# EAGLE design schemat (EAGLE 9.2.2)
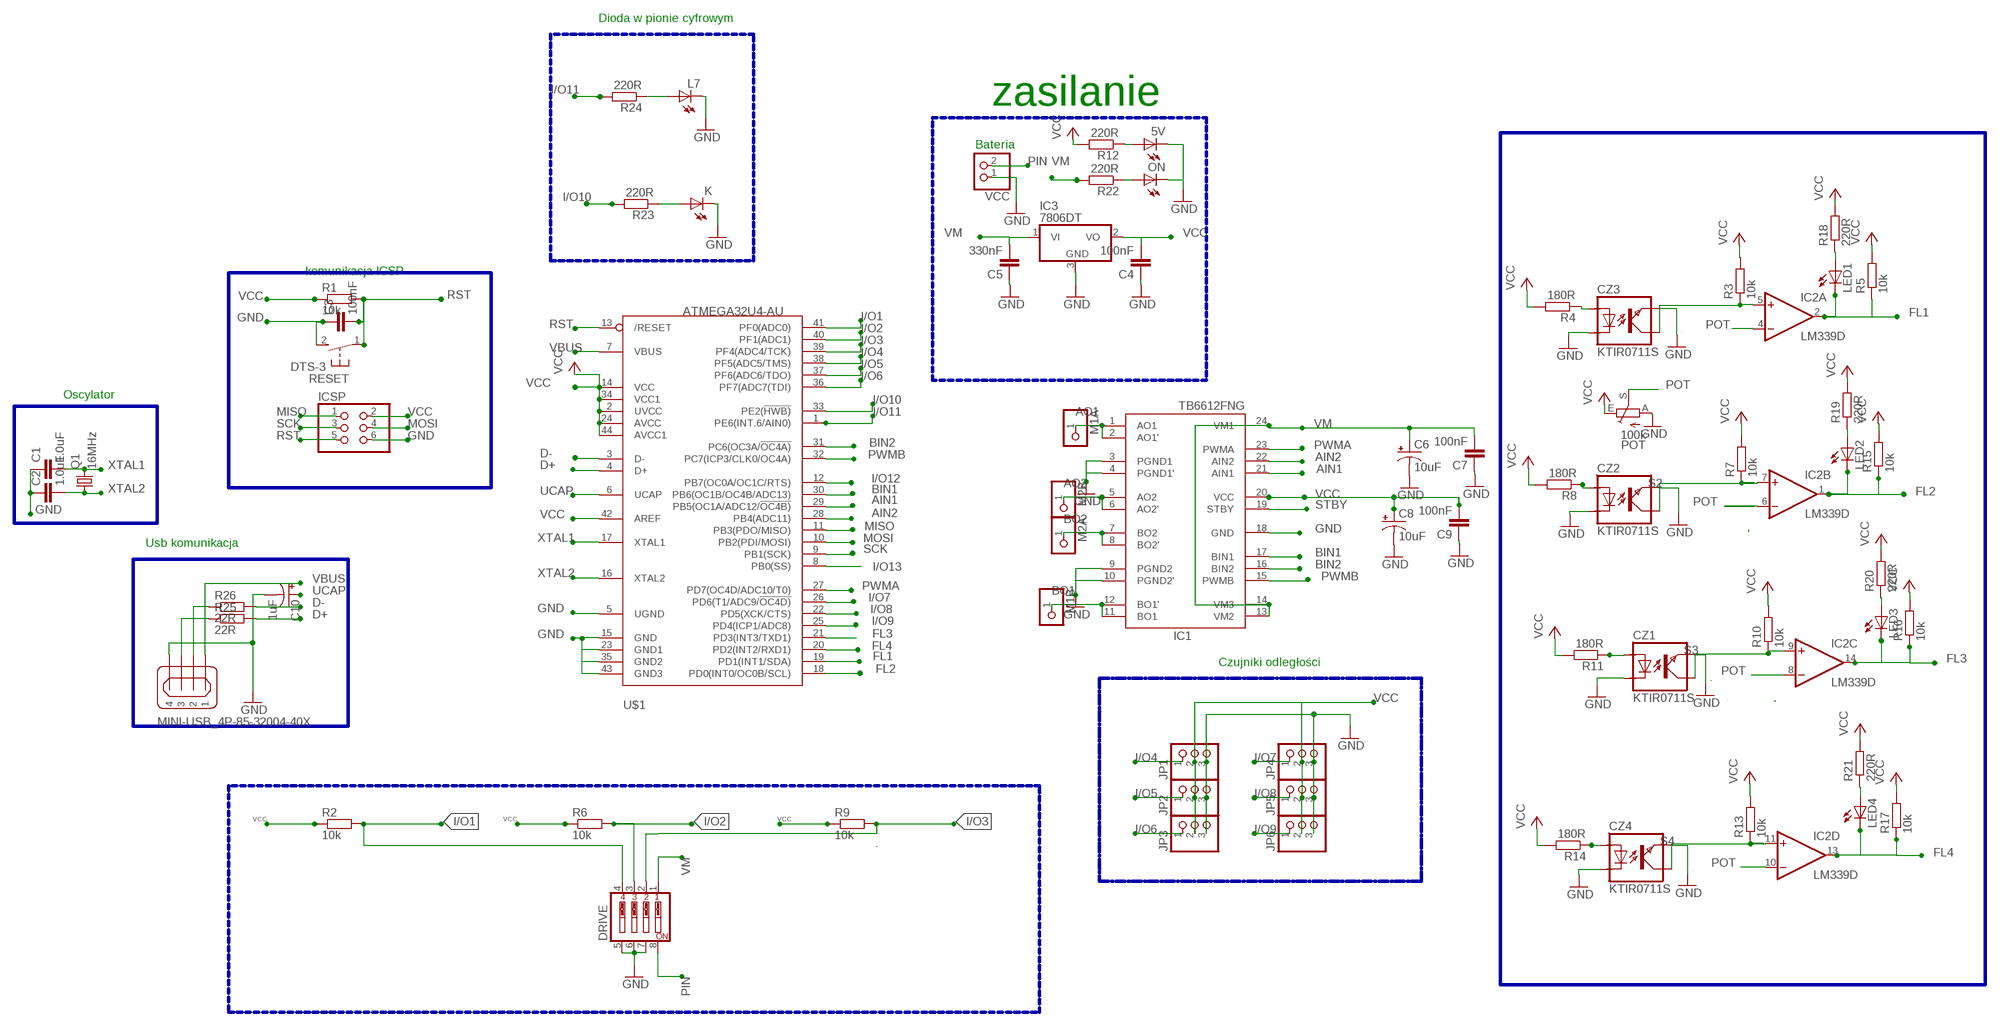
[diagram p0: schematic, sheet 1]

## Parts
5V  LEDCHIP-LED0805  [CHIP-LED0805]
C1  1.0uF  C-EUC0805  [C0805]
C2  1.0uF  C-EUC0805  [C0805]
C3  100nF  C-EUC0805  [C0805]
C4  100nF  C-EUC0805  [C0805]
C5  330nF  C-EUC0805  [C0805]
C6  10uF  CPOL-USUD-4X5,8  [UD-4X5,8_NICHICON]
C7  100nF  C-EUC0805  [C0805]
C8  10uF  CPOL-USUD-4X5,8  [UD-4X5,8_NICHICON]
C9  100nF  C-EUC0805  [C0805]
C10  1uF  CPOL-USUD-4X5,8  [UD-4X5,8_NICHICON]
CZ1  KTIR0711S  [TOP]
CZ2  KTIR0711S  [TOP]
CZ3  KTIR0711S  [TOP]
CZ4  KTIR0711S  [TOP]
DRIVE  SW_DIP-4  [EDG-04]
IC1  TB6612FNG  [SSOP24]
IC2  LM339D  [SO14]
IC3  7806DT  [TO252]
ICSP  PINHD-2X3  [2X03]
JP1  PINHD-1X3  [1X03]
JP2  PINHD-1X3  [1X03]
JP3  PINHD-1X3  [1X03]
JP4  PINHD-1X3  [1X03]
JP5  PINHD-1X3  [1X03]
JP6  PINHD-1X3  [1X03]
K  LEDCHIP-LED0805  [CHIP-LED0805]
L7  LEDCHIP-LED0805  [CHIP-LED0805]
LED1  LEDCHIP-LED0805  [CHIP-LED0805]
LED2  LEDCHIP-LED0805  [CHIP-LED0805]
LED3  LEDCHIP-LED0805  [CHIP-LED0805]
LED4  LEDCHIP-LED0805  [CHIP-LED0805]
M1A  PINHD-1X1  [1X01]
M1B  PINHD-1X1  [1X01]
M2A  PINHD-1X1  [1X01]
M2B  PINHD-1X1  [1X01]
ON  LEDCHIP-LED0805  [CHIP-LED0805]
POT  100k  TRIM_EU-CA6V  [CA6V]
Q1  16MHz  CSM-7X-DU  [CSM-7X-DU]
R1  10k  R-EU_R0805  [R0805]
R2  10k  R-EU_R0805  [R0805]
R3  10k  R-EU_R0805  [R0805]
R4  180R  R-EU_R0805  [R0805]
R5  10k  R-EU_R0805  [R0805]
R6  10k  R-EU_R0805  [R0805]
R7  10k  R-EU_R0805  [R0805]
R8  180R  R-EU_R0805  [R0805]
R9  10k  R-EU_R0805  [R0805]
R10  10k  R-EU_R0805  [R0805]
R11  180R  R-EU_R0805  [R0805]
R12  220R  R-EU_R0805  [R0805]
R13  10k  R-EU_R0805  [R0805]
R14  180R  R-EU_R0805  [R0805]
R15  10k  R-EU_R0805  [R0805]
R16  10k  R-EU_R0805  [R0805]
R17  10k  R-EU_R0805  [R0805]
R18  220R  R-EU_R0805  [R0805]
R19  220R  R-EU_R0805  [R0805]
R20  220R  R-EU_R0805  [R0805]
R21  220R  R-EU_R0805  [R0805]
R22  220R  R-EU_R0805  [R0805]
R23  220R  R-EU_R0805  [R0805]
R24  220R  R-EU_R0805  [R0805]
R25  22R  R-EU_R0805  [R0805]
R26  22R  R-EU_R0805  [R0805]
RESET  DTS-3  [DTS-3]
U$1  ATMEGA32U4-AU  [TQFP44]
USB  MINI-USB_4P-85-32004-40X  [85-32004-40X]
VCC  PINHD-1X2  [1X02]

## Nets
AIN1: IC1.21(AIN1) U$1.29(PB5(OC1A/ADC12/!OC4B))
AIN2: IC1.22(AIN2) U$1.28(PB4(ADC11))
AO1: IC1.1(AO1) IC1.2(AO1') M1A.1
AO2: IC1.5(AO2) IC1.6(AO2') M2B.1
BIN1: IC1.17(BIN1) U$1.30(PB6(OC1B/OC4B/ADC13))
BIN2: IC1.16(BIN2) U$1.31(PC6(OC3A/!OC4A))
BO1: IC1.11(BO1) IC1.12(BO1') M1B.1
BO2: IC1.7(BO2) IC1.8(BO2') M2A.1
D+: R25.2 U$1.4(D+)
D-: R26.2 U$1.3(D-)
FL1: IC2.2(A:OUT) LED1.C R5.1 U$1.19(PD1(INT1/SDA))
FL2: IC2.1(B:OUT) LED2.C R15.1 U$1.18(PD0(INT0/OC0B/SCL))
FL3: IC2.14(C:OUT) LED3.C R16.1 U$1.21(PD3(INT3/TXD1))
FL4: IC2.13(D:OUT) LED4.C R17.1 U$1.20(PD2(INT2/RXD1))
GND: 5V.C C1.1 C2.1 C3.1 C4.1 C5.1 C6.- C7.1 C8.- C9.1 C10.- CZ1.EMITER CZ1.KATODA CZ2.EMITER CZ2.KATODA CZ3.EMITER CZ3.KATODA CZ4.EMITER CZ4.KATODA DRIVE.5 DRIVE.6 DRIVE.7 IC1.3(PGND1) IC1.4(PGND1') IC1.9(PGND2) IC1.10(PGND2') IC1.18(GND) IC3.3(GND) ICSP.6 JP1.3 JP2.3 JP3.3 JP4.3 JP5.3 JP6.3 K.C L7.C ON.C POT.A RESET.2 U$1.5(UGND) U$1.15(GND) U$1.23(GND1) U$1.35(GND2) U$1.43(GND3) USB.4 VCC.1
I/O1: DRIVE.4 R2.2 U$1.41(PF0(ADC0))
I/O2: DRIVE.3 R6.2 U$1.40(PF1(ADC1))
I/O3: DRIVE.2 R9.2 U$1.39(PF4(ADC4/TCK))
I/O4: JP1.1 U$1.38(PF5(ADC5/TMS))
I/O5: JP2.1 U$1.37(PF6(ADC6/TDO))
I/O6: JP3.1 U$1.36(PF7(ADC7(TDI))
I/O7: JP4.1 U$1.26(PD6(T1/ADC9/!OC4D))
I/O8: JP5.1 U$1.22(PD5(XCK/CTS))
I/O9: JP6.1 U$1.25(PD4(ICP1/ADC8))
I/O10: R23.2 U$1.33(PE2(!HWB))
I/O11: R24.2 U$1.1(PE6(INT.6/AIN0))
I/O12: U$1.12(PB7(OC0A/OC1C/RTS))
I/O13: U$1.8(PB0(SS))
MISO: ICSP.1 U$1.11(PB3(PDO/MISO))
MOSI: ICSP.4 U$1.10(PB2(PDI/MOSI))
N$1: CZ3.KOLEKTOR IC2.5(A:+IN) R3.1
N$2: K.A R23.1
N$7: 5V.A R12.1
N$9: ON.A R22.1
N$11: R26.1 USB.2
N$12: R25.1 USB.3
N$13: LED1.A R18.1
N$14: CZ3.ANODA R4.1
N$15: LED2.A R19.1
N$16: LED3.A R20.1
N$17: LED4.A R21.1
N$18: L7.A R24.1
N$19: CZ2.ANODA R8.1
N$23: CZ1.ANODA R11.1
N$27: CZ4.ANODA R14.1
PIN: DRIVE.8 VCC.2
POT: IC2.4(A:-IN) IC2.6(B:-IN) IC2.8(C:-IN) IC2.10(D:-IN) POT.S
PWMA: IC1.23(PWMA) U$1.27(PD7(OC4D/ADC10/T0))
PWMB: IC1.15(PWMB) U$1.32(PC7(ICP3/CLK0/OC4A))
RST: C3.2 ICSP.5 R1.2 RESET.1 U$1.13(/RESET)
S2: CZ2.KOLEKTOR IC2.7(B:+IN) R7.1
S3: CZ1.KOLEKTOR IC2.9(C:+IN) R10.1
S4: CZ4.KOLEKTOR IC2.11(D:+IN) R13.1
SCK: ICSP.3 U$1.9(PB1(SCK))
STBY: IC1.19(STBY)
UCAP: C10.+ U$1.6(UCAP)
VBUS: U$1.7(VBUS) USB.1
VCC: C4.2 C8.+ C9.2 IC1.20(VCC) IC3.2(VO) ICSP.2 JP1.2 JP2.2 JP3.2 JP4.2 JP5.2 JP6.2 POT.E R1.1 R2.1 R3.2 R4.2 R5.2 R6.1 R7.2 R8.2 R9.1 R10.2 R11.2 R12.2 R13.2 R14.2 R15.2 R16.2 R17.2 R18.2 R19.2 R20.2 R21.2 U$1.2(UVCC) U$1.14(VCC) U$1.24(AVCC) U$1.34(VCC1) U$1.42(AREF) U$1.44(AVCC1)
VM: C5.2 C6.+ C7.2 DRIVE.1 IC1.13(VM2) IC1.14(VM3) IC1.24(VM1) IC3.1(VI) R22.2
XTAL1: C1.2 Q1.2 U$1.17(XTAL1)
XTAL2: C2.2 Q1.1 U$1.16(XTAL2)

## Buses
B$1
B$2
B$4
B$5
B$3
B$6
B$7
B$8

## Notes on the sheet
- Dioda w pionie cyfrowym
- zasilanie
- Bateria
- komunikacja ICSP
- Oscylator
- Usb komunikacja
- Czujniki odległości

## Power pins joined to a net without a drawn wire
GND: IC2.12(P:GND)
VCC: IC2.3(P:V+)

## Library data of the parts
5V K L7 LED1-LED4 ON = led:LED: LED OSRAM: - CHIPLED LG R971, LG N971, LY N971, LG Q971, LY Q971, LO R971, LY R971 LH N974, LH R974 LS Q976, LO Q976, LY Q976 LO Q996 - Hyper CHIPLED LW Q18S LB Q993, LB Q99A, LB R99A - SideLED LS A670, LO A670, LY A670, LG A670, LP A670 LB A673, LV A673, LT A673, LW A673 LH A674 LY A675 LS A676, LA A676, LO A676, LY A676, LW A676 LS A679, LY A679, LG A679 - Hyper Micro SIDELED® LS Y876, LA Y876, LO Y876, LY Y876 LT Y87S - SmartLED LW L88C, LW L88S LB L89C, LB L89S, LG L890 LS L89K, LO L89K, LY L89K LS L896, LA L896, LO L896, LY L896 - TOPLED LS T670, LO T670, LY T670, LG T670, LP T670 LSG T670, LSP T670, LSY T670, LOP T670, LYG T670 LG T671, LOG T671, LSG T671 LB T673, LV T673, LT T673, LW T673 LH T674 LS T676, LA T676, LO T676, LY T676, LB T676, LH T676, LSB T676, LW T676 LB T67C, LV T67C, LT T67C, LS T67K, LO T67K, LY T67K, LW E67C LS E67B, LA E67B, LO E67B, LY E67B, LB E67C, LV E67C, LT E67C LW T67C LS T679, LY T679, LG T679 LS T770, LO T770, LY T770, LG T770, LP T770 LB T773, LV T773, LT T773, LW T773 LH T774 LS E675, LA E675, LY E675, LS T675 LS T776, LA T776, LO T776, LY T776, LB T776 LHGB T686 LT T68C, LB T68C - Hyper Mini TOPLED® LB M676 - Mini TOPLED Santana® LG M470 LS M47K, LO M47K, LY M47K Source: http://www.osram.convergy.de LUXEON: - LUMILED® LXK2-PW12-R00, LXK2-PW12-S00, LXK2-PW14-U00, LXK2-PW14-V00 LXK2-PM12-R00, LXK2-PM12-S00, LXK2-PM14-U00 LXK2-PE12-Q00, LXK2-PE12-R00, LXK2-PE12-S00, LXK2-PE14-T00, LXK2-PE14-U00 LXK2-PB12-K00, LXK2-PB12-L00, LXK2-PB12-M00, LXK2-PB14-N00, LXK2-PB14-P00, LXK2-PB14-Q00 LXK2-PR12-L00, LXK2-PR12-M00, LXK2-PR14-Q00, LXK2-PR14-R00 LXK2-PD12-Q00, LXK2-PD12-R00, LXK2-PD12-S00 LXK2-PH12-R00, LXK2-PH12-S00 LXK2-PL12-P00, LXK2-PL12-Q00, LXK2-PL12-R00 Source: www.luxeon.com KINGBRIGHT: KA-3528ASYC Source: www.kingbright.com
C1-C5 C7 C9 = rcl:C-EU: CAPACITOR, European symbol; SPICEPREFIX: C
C6 C8 C10 = rcl:CPOL-US: POLARIZED CAPACITOR, American symbol; SPICEPREFIX: C
CZ1-CZ4 = ktir0711s:KTIR0711S
DRIVE = special:SW_DIP-4: DIP SWITCH
IC1 = adafruit:TB6612FNG: TB6612FNG MOS dual H-bridge motor driver, 1.2A current 3.2A peak 3 or 5v logic and 3-15v motor
IC2 = linear:LM339: Low Power Low Offset Voltage Quad Comparators with open collector; LM139/LM239/LM339/LM2901/LM3302
IC3 = linear3:78*: Positive VOLTAGE REGULATOR Source: http://cache.national.com/ds/LM/LM78L05.pdf http://www.fairchildsemi.com/ds/LM/LM7805.pdf
ICSP = pinhead:PINHD-2X3: PIN HEADER
JP1-JP6 = pinhead:PINHD-1X3: PIN HEADER
M1A M1B M2A M2B = pinhead:PINHD-1X1: PIN HEADER
POT = pot:TRIM_EU-: POTENTIOMETER
Q1 = crystal:CSM-7X-DU: SMD CRYSTAL Source: www.ecsxtal.com .. Crystal 3.6864MHz CSM_7X_DU.PDF; OC_FARNELL: unknown; OC_NEWARK: unknown
R1-R26 = rcl:R-EU_: RESISTOR, European symbol; SPICEPREFIX: R
RESET = switch-tact (1):DTS-3
U$1 = adafruit:ATMEGA32U4: http://www.ladyada.net/library/eagle
USB = con-cypressindustries:MINI-USB_4P-: MINI USB 4 Pol. Source: www.cypressindustries.com; OC_FARNELL: unknown; OC_NEWARK: unknown
VCC = pinhead:PINHD-1X2: PIN HEADER

## Board
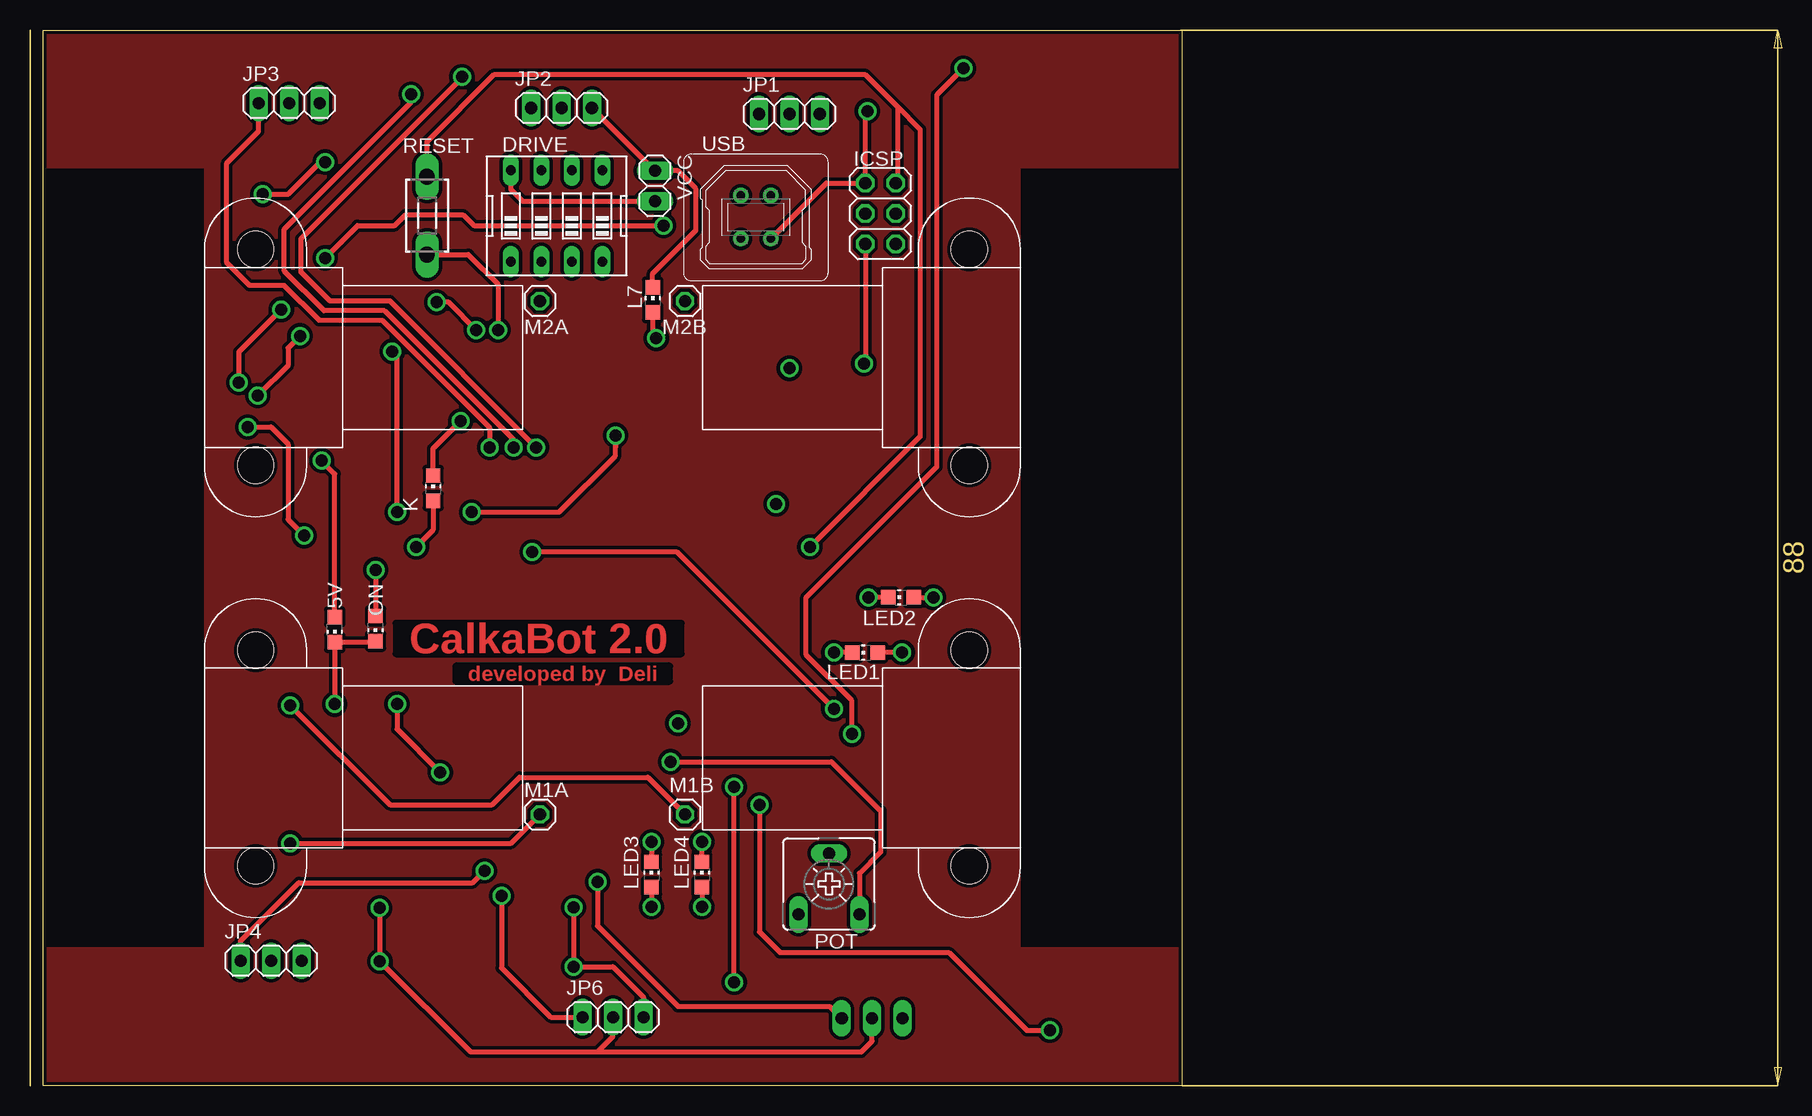
[diagram p1: board, top side]
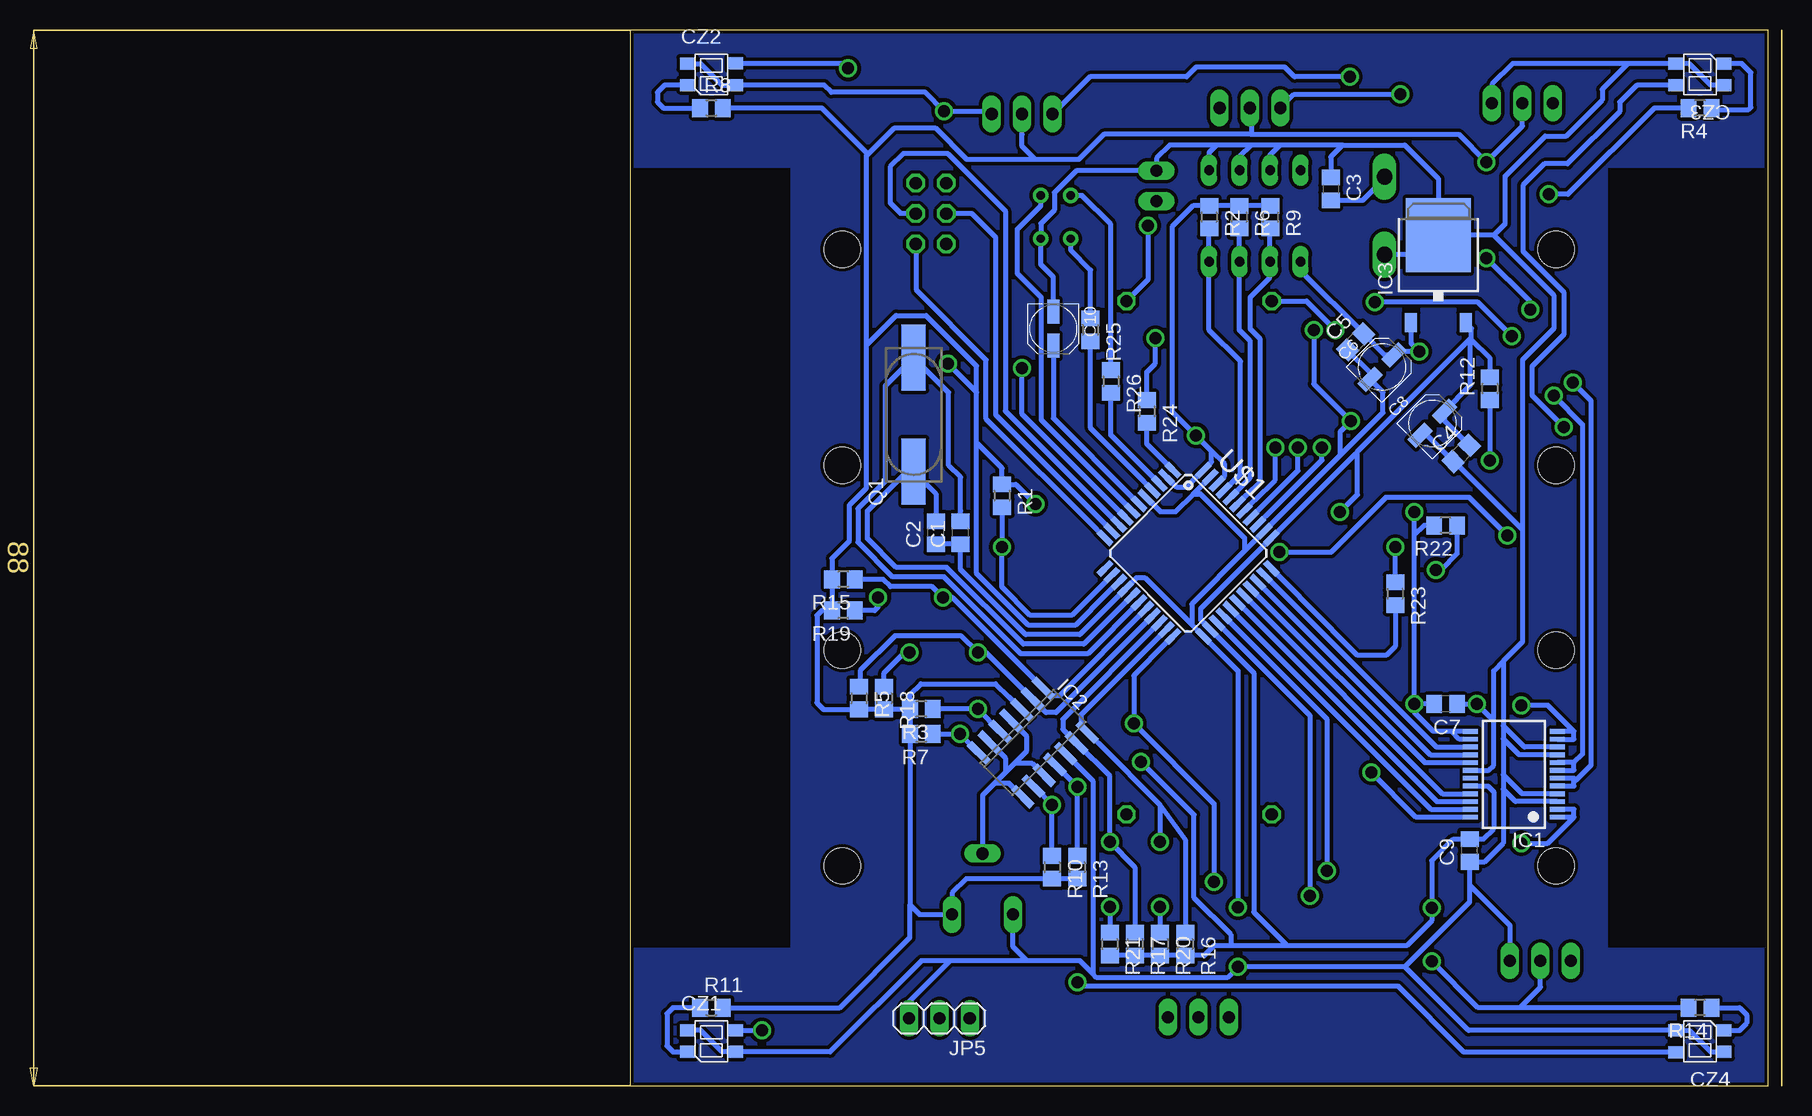
[diagram p2: board, bottom side, seen from below]

Size 94.9 x 88 mm. Coordinates in mm from the lower left corner, seen from the top.
Outline: 0,0 0,88 94.9,88 94.9,0 0,0
Copper layers (1*16): Top 0.035mm / dielectric 1.5mm / Bottom 0.035mm
Design rules "default *": minimum track width 6mil, minimum drill 0.35mm, track to track 0.3mm, track to pad 0.3mm, pad to pad 0.3mm, via to via 0.3mm, smd to smd 6mil, copper to edge 0.3mm, drill to drill 0.3mm, minimum pad ring 10mil, minimum via ring 8mil, stop-mask expansion 4mil, vias tented up to drill 0mil, thermal gap 10mil

### Footprints (pad centres in the part's own frame; a part is rotated, then mirrored left to right if it is on the bottom)
CHIP-LED0805 = smd 1.2 x 1.2: A 0,-1.05; C 0,1.05
C0805 = smd 1.3 x 1.5: 1 -0.95,0; 2 0.95,0
UD-4X5,8_NICHICON = smd 2 x 1: + 1.425,0; - -1.425,0
TOP = smd 1.27 x 1: ANODA -1.985,-0.9; EMITER -1.985,0.9; KATODA 1.985,-0.9; KOLEKTOR 1.985,0.91
EDG-04 = drill 0.813 long: 1 -3.81,-3.81; 2 -1.27,-3.81; 3 1.27,-3.81; 4 3.81,-3.81; 5 3.81,3.81; 6 1.27,3.81; 7 -1.27,3.81; 8 -3.81,3.81
SSOP24 = smd 0.4 x 1.25: 1 -3.575,-3.625; 2 -2.925,-3.625; 3 -2.275,-3.625; 4 -1.625,-3.625; 5 -0.975,-3.625; 6 -0.325,-3.625; 7 0.325,-3.625; 8 0.975,-3.625; 9 1.625,-3.625; 10 2.275,-3.625; 11 2.925,-3.625; 12 3.575,-3.625; 13 3.575,3.625; 14 2.925,3.625; 15 2.275,3.625; 16 1.625,3.625; 17 0.975,3.625; 18 0.325,3.625; 19 -0.325,3.625; 20 -0.975,3.625; 21 -1.625,3.625; 22 -2.275,3.625; 23 -2.925,3.625; 24 -3.575,3.625
SO14 = smd 0.6 x 2.2: 1 -3.81,-2.6; 2 -2.54,-2.6; 3 -1.27,-2.6; 4 0,-2.6; 5 1.27,-2.6; 6 2.54,-2.6; 7 3.81,-2.6; 8 3.81,2.6; 9 2.54,2.6; 10 1.27,2.6; 11 0,2.6; 12 -1.27,2.6; 13 -2.54,2.6; 14 -3.81,2.6
TO252 = smd 1 x 1.6: 1 -2.28,-4.8; 2 2.28,-4.8 | smd 5.4 x 6.2: 3 0,2.5
2X03 = drill 1.016 octagon: 1 -2.54,-1.27; 2 -2.54,1.27; 3 0,-1.27; 4 0,1.27; 5 2.54,-1.27; 6 2.54,1.27
1X03 = drill 1.016 long: 1 -2.54,0; 2 0,0; 3 2.54,0
1X01 = drill 1.016 octagon: 1 0,0
CA6V = drill 1.016 long: A -2.54,-2.54; E 2.54,-2.54; S 0,2.54
CSM-7X-DU = smd 5.5 x 2: 1 -4.75,0; 2 4.75,0
R0805 = smd 1.3 x 1.5: 1 -0.95,0; 2 0.95,0
DTS-3 = drill 1.3 long: 1 -3.25,0; 2 3.25,0
TQFP44 = smd 1.5 x 0.5: 1 -5.8,4; 2 -5.8,3.2; 3 -5.8,2.4; 4 -5.8,1.6; 5 -5.8,0.8; 6 -5.8,0; 7 -5.8,-0.8; 8 -5.8,-1.6; 9 -5.8,-2.4; 10 -5.8,-3.2; 11 -5.8,-4; 23 5.8,-4; 24 5.8,-3.2; 25 5.8,-2.4; 26 5.8,-1.6; 27 5.8,-0.8; 28 5.8,0; 29 5.8,0.8; 30 5.8,1.6; 31 5.8,2.4; 32 5.8,3.2; 33 5.8,4 | smd 0.5 x 1.5: 12 -4,-5.8; 13 -3.2,-5.8; 14 -2.4,-5.8; 15 -1.6,-5.8; 16 -0.8,-5.8; 17 0,-5.8; 18 0.8,-5.8; 19 1.6,-5.8; 20 2.4,-5.8; 21 3.2,-5.8; 22 4,-5.8; 34 4,5.8; 35 3.2,5.8; 36 2.4,5.8; 37 1.6,5.8; 38 0.8,5.8; 39 0,5.8; 40 -0.8,5.8; 41 -1.6,5.8; 42 -2.4,5.8; 43 -3.2,5.8; 44 -4,5.8
HP_NM = hole 3: -9,-3; 9,-3
85-32004-40X = drill 0.7 pad 1.27: 1 1.25,1.8; 2 -1.25,1.8; 3 -1.25,-1.8; 4 1.25,-1.8
1X02 = drill 1.016 long: 1 -1.27,0; 2 1.27,0

### Placement (x,y rotation side)
5V  24.3,38 180 top
C1  67.33,46.09 90 bottom
C2  69.38,46.09 90 bottom
C3  36.48,74.75 270 bottom
C4  25.6,52.7 45 bottom
C5  34.4,62 45 bottom
C6  32.2,59.9 45 bottom
C7  26.9,31.8 180 bottom
C8  28,55.2 45 bottom
C9  24.9,19.6 90 bottom
C10  59.6,63.1 270 bottom
CZ1  88.1,3.7 0 bottom
CZ2  88.1,84.3 0 bottom
CZ3  5.7,84.3 180 bottom
CZ4  5.7,3.7 180 bottom
DRIVE  42.8,72.5 0 top
IC1  21.21,25.95 90 bottom
IC2  61.3,28.6 225 bottom
IC3  27.5,68.4 0 bottom
ICSP  69.8,72.7 90 top
JP1  62.2,81 0 top
JP2  43.2,81.5 0 top
JP3  20.5,81.9 0 top
JP4  19,10.4 0 top
JP5  69.1,5.6 180 bottom
JP6  47.5,5.7 0 top
K  32.5,49.8 0 top
L7  50.8,65.5 0 top
LED1  68.5,36.1 90 top
LED2  71.5,40.7 90 top
LED3  50.7,17.6 0 top
LED4  54.9,17.6 0 top
M1A  41.4,22.6 0 top
M1B  53.5,22.6 0 top
M2A  41.4,65.4 0 top
M2B  53.5,65.4 0 top
ON  27.7,38.1 180 top
POT  65.5,16.8 0 top
Q1  71.24,55.95 90 bottom
R1  63.88,49.17 270 bottom
R2  46.6,72.4 270 bottom
R3  70.6,31.4 180 bottom
R4  5.7,81.5 180 bottom
R5  75.8,32.3 270 bottom
R6  44.1,72.4 270 bottom
R7  70.6,29.3 180 bottom
R8  88.1,81.5 0 bottom
R9  41.5,72.4 270 bottom
R10  59.7,18.2 270 bottom
R11  88.1,6.5 0 bottom
R12  23.2,58.1 90 bottom
R13  57.6,18.2 270 bottom
R14  5.7,6.5 180 bottom
R15  77.1,42.2 180 bottom
R16  48.6,11.8 270 bottom
R17  52.8,11.8 270 bottom
R18  73.7,32.3 270 bottom
R19  77.1,39.6 180 bottom
R20  50.7,11.8 270 bottom
R21  54.9,11.8 270 bottom
R22  26.9,46.7 180 bottom
R23  31.1,41 270 bottom
R24  51.8,56.2 270 bottom
R25  56.5,63 270 bottom
R26  54.8,58.7 270 bottom
RESET  31.99,72.52 270 top
U$1  48.35,44.38 315 bottom
U$6  [HP_NM]  20.7,27.3 270 top
U$7  [HP_NM]  20.7,60.7 270 top
U$8  [HP_NM]  74.2,60.7 90 top
U$9  [HP_NM]  74.2,27.3 90 top
USB  59.4,72.4 0 top
VCC  51,75 270 top

### Tracks (layer width: path | path; a pad name or v marks a point on that pad's centre or on a via)
AIN1
  Bottom 0.4: 43.47,40.63 U$1.29 43.47,40.63 | 43.47,40.63 27.16,24.32 IC1.21 | 43.47,40.63
AIN2
  Bottom 0.4: 43.69,39.72 U$1.28 43.69,39.72 | 43.69,39.72 27.65,23.68 IC1.22 | 43.69,39.72
AO1  (via drill 1 pad 1.3)
  Top 0.4: v20.6,20.2 39,20.2 M1A.1
  Bottom 0.4: IC1.2 16.2,23.02 16.2,22.38 16.23,22.38 | v20.6,20.2 18.4,20.2 16.23,22.38 | 16.23,22.38 IC1.1
AO2  (via drill 1 pad 1.3)
  Top 0.4: v23.5,69 26.2,71.7 29.3,71.7 30.2,72.6 35,72.6 35.9,71.7 v51.7,71.7 | v19.85,64.7 16.3,61.15 v16.3,58.6
  Bottom 0.4: IC1.6 16.2,25.62 16.2,25.3 | IC1.5 16.2,24.97 16.2,25.3 | 16.2,25.3 15.92,25.57 15.91,25.57 14.79,26.69 14.79,57.09 v16.3,58.6 | v19.85,64.7 19.85,65.35 v23.5,69 | v51.7,71.7 51.7,67.2 M2B.1
BIN1
  Bottom 0.4: 42.9,41.2 U$1.30 42.9,41.2 | 42.9,41.2 28.63,26.93 IC1.17 | 42.9,41.2
BIN2
  Bottom 0.4: 42.24,41.66 U$1.31 42.24,41.66 | 42.24,41.66 28.15,27.57 IC1.16 | 42.24,41.66
BO1  (via drill 1 pad 1.3)
  Top 0.4: M1B.1 50.4,25.7 39.7,25.7 37.4,23.4 28.9,23.4 v20.6,31.7
  Bottom 0.4: 16.2,29.52 IC1.12 | 16.2,29.52 16.2,28.88 IC1.11 17.78,28.88 | 16.2,29.52 18.38,31.7 v20.6,31.7
BO2  (via drill 1 pad 1.3)
  Top 0.4: v36.1,63 33.8,65.3 v32.8,65.3 | v21.4,62.5 20.4,61.5 20.4,60.02 v17.89,57.51
  Bottom 0.4: 16.2,26.93 IC1.8 | IC1.7 16.2,26.27 16.2,26.93 | 16.2,26.93 15.5,27.62 15.5,55.12 v17.89,57.51 | M2A.1 38.5,65.4 v36.1,63 | v21.4,62.5 24.2,65.3 v32.8,65.3
D+
  Bottom 0.4: 52.05,50.35 U$1.4 52.05,50.35 | 52.05,50.35 56.5,54.79 R25.2 | 52.05,50.35
D-
  Bottom 0.4: 51.14,50.56 U$1.3 51.14,50.56 | 51.14,50.56 | R26.2 54.8,54.22 51.14,50.56
FL1  (via drill 1 pad 1.4)
  Top 0.4: LED1.C v65.9,36.1
  Bottom 0.4: U$1.19 59.37,31.1 60.21,31.1 IC2.2 | IC2.2 65.21,36.1 v65.9,36.1 | 66,36.1 v65.9,36.1 | IC2.2 | U$1.19 | R5.1 75.7,33.35 75.7,34.6 72.8,37.5 67.3,37.5 v65.9,36.1
FL2  (via drill 1 pad 1.4)
  Top 0.4: LED2.C v68.8,40.7
  Bottom 0.4: IC2.1 68.01,40.7 v68.8,40.7 69.69,41.59 73.18,41.59 73.79,42.2 R15.1 | U$1.18 59.1,32.5 59.81,32.5 IC2.1 | U$1.18 | IC2.1
FL3  (via drill 1 pad 1.4)
  Top 0.4: v50.7,20.3 LED3.C
  Bottom 0.4: IC2.14 57.3,30 57.3,30.9 51.35,36.85 | 50.7,23.39 v50.7,20.3 | IC2.14 | 50.7,23.39 55.86,28.54 IC2.14 | R16.1 48.6,20.49 50.7,23.39 | 51.35,36.85 U$1.21 51.35,36.85 | 51.35,36.85 | IC2.14
FL4  (via drill 1 pad 1.4)
  Top 0.4: LED4.C v54.9,20.3
  Bottom 0.4: IC2.13 58.8,29.7 58.8,30.54 50.92,38.42 | 50.92,38.42 U$1.20 50.92,38.42 | R17.1 52.8,18.2 v54.9,20.3 54.9,25.79 IC2.13 | 50.92,38.42 | IC2.13
GND  (via drill 1 pad 1.3)
  Top 0.4: v44.2,14.85 v44.2,9.9 47.5,9.9 50.04,7.36 JP6.3 | ON.C 27.6,36.95 5V.C v24.3,31.8 | K.C 32.5,53.1 v34.8,55.4 | USB.4 65.29,75.24 ICSP.6 68.53,81.08 v68.7,81.25 | RESET.2 35.43,69.27 37.9,66.8 v37.9,63 | L7.C 50.8,67.7 54.4,71.3 54.4,74.77 52.9,76.27 VCC.1 50.97,76.27 JP2.3
  Bottom 0.4: C2.1 C1.1 67.33,43.02 61.91,37.6 57.39,37.6 53.15,41.85 | IC1.18 23.33,26.27 22.9,26.7 22.9,30.4 | IC2.12 56.3,25.4 56.3,9.3 | 53.15,41.85 52.65,42.35 51.97,42.35 48.06,38.44 | 43.65,44.55 U$1.35 | U$1.35 40.95,47.25 | 40.95,47.25 35.7,52.5 | 22.9,70.9 IC3.3 | 22.9,30.4 22.9,34.58 22.1,35.38 | 22.9,70.9 17.9,65.9 17.9,63.1 20.5,60.5 20.5,46.36 | 22.1,35.38 22.1,30 | 22.1,30 22.1,28.9 | 22.1,28.9 22.1,25.9 | 22.1,25.9 22.1,24.7 | 22.1,24.7 22.1,20.2 23.65,18.65 C9.1 24.9,16.7 | IC1.10 20.33,28.22 22.1,30 | 27.5,72.1 27.5,75.6 30.3,78.4 35.5,78.4 | 27.5,72.1 27.5,71.3 | 27.5,71.3 IC3.3 | C6.- 33.21,59.46 C5.1 | C8.- 28.44,54.19 C4.1 | IC1.9 20.78,27.57 22.1,28.9 | 22.9,30.4 v24.3,31.8 C7.1 | U$1.5 50.68,47.84 49.42,47.84 47.93,49.33 | C6.- 32.12,57.8 32.12,56.09 35.7,52.5 | 22.1,35.38 20.5,36.98 20.5,46.36 | 26.17,52.03 C4.1 | 24.9,16.7 24.9,15.3 30.3,9.9 | IC1.4 20.53,24.32 22.1,25.9 | IC1.3 21.08,23.68 22.1,24.7 | v44.2,14.85 44.2,34.57 U$1.23 | 43.65,44.55 48.06,40.14 48.06,38.44 | U$1.43 47.93,49.33 | 47.93,49.33 47.33,49.33 43.65,45.65 43.65,44.55 | C3.1 36.2,75.98 | C10.- 59.6,67.4 60.65,68.45 USB.4 60.65,71.87 59.52,73 59.52,74.44 57.69,76.27 VCC.1 51,77.3 49.9,78.4 46,78.4 | CZ1.EMITER 89,4.6 87.2,2.8 CZ1.KATODA 78.2,2.8 70.6,10.4 68.2,10.4 | CZ4.EMITER 4.8,2.8 6.6,4.6 CZ4.KATODA 25,4.6 30.3,9.9 | CZ3.EMITER 4.8,83.4 6.6,85.2 CZ3.KATODA 11.7,85.2 | CZ2.EMITER 89,85.2 87.2,83.4 CZ2.KATODA 78.7,83.4 78.1,82.8 70.25,82.8 v68.7,81.25 64.99,81.25 JP1.3 | 31.47,69.27 RESET.2 29.13,69.27 IC3.3 | C3.1 36,75.7 | C3.1 36.48,77.42 35.5,78.4 | 35.5,78.4 40.7,78.4 | 40.7,78.4 43.1,78.4 | 43.1,78.4 46,78.4 | 43.1,78.4 44.07,77.43 DRIVE.6
  Bottom 0.4: 46,78.4 46.61,77.79 DRIVE.5 | U$1.15 53.15,41.85 | 53.15,41.85 | POT.A 62.96,11.56 61.8,10.4 | 61.8,10.4 68.2,10.4 | U$1.35 | 20.5,46.36 26.17,52.03 | U$1.23 | U$1.23 48.06,38.44 | DRIVE.7 41.53,77.57 40.7,78.4 | U$1.5 | C6.- | C5.1 | U$1.43 | IC2.12 | C8.- | C4.1 26.17,52.03 | 26.17,52.03 | C4.1 | v34.8,55.4 34.85,55.35 | 34.85,55.35 35.7,54.5 35.7,52.5 | 30.3,9.9 v44.2,9.9 45.1,9 56,9 56.3,9.3 | 56.3,9.3 57.4,10.4 61.8,10.4 | 11.7,85.2 13.85,83.05 13.85,82.15 16.85,79.15 18.6,79.15 21.93,75.83 21.93,71.88 22.9,70.9 | JP4.3 21.54,13.34 24.9,16.7 | v37.9,63 37.9,58.5 34.85,55.45 34.85,55.35 | JP5.3 71.64,6.96 68.2,10.4 | JP3.3 23.04,83.46 21.3,85.2 11.7,85.2 | U$1.35 40.95,47.25 | 40.95,47.25 | 26.1,72.1 27.5,72.1 | 25.9,71.4 26.9,71.4 27,71.3 27.5,71.3
I/O1
  Bottom 0.4: U$1.41 44,51 44,60.39 46.61,63 DRIVE.4 R2.2 | U$1.41
I/O2
  Bottom 0.4: R6.2 44.07,71.42 DRIVE.3 44.1,68.66 44.1,63 43.2,62.1 43.2,50.66 U$1.40 | U$1.40
I/O3
  Bottom 0.4: 41.56,71.39 R9.2 41.53,71.42 | 41.53,71.36 41.56,71.39 | 41.56,71.39 41.56,68.72 DRIVE.2 41.6,68.62 41.6,67.3 43.2,65.7 43.2,63.09 42.4,62.29 42.4,50.33 43.47,49.27 | U$1.39 43.47,49.27 | 43.47,49.27
I/O4  (via drill 1 pad 1.3)
  Top 0.4: v41.1,53.2 28.9,65.4 23.9,65.4 21.5,67.8 21.5,70.6 34.95,84.05 v34.9,84.1
  Bottom 0.4: v41.1,53.2 41.1,50.5 42.8,48.8 | 42.8,48.8 U$1.38 42.8,48.8 | 42.8,48.8 | v34.9,84.1 39.5,84.1 40.3,84.9 44.6,84.9 47.7,84.9 48.5,84.1 56.56,84.1 JP1.1
I/O5  (via drill 1 pad 1.3)
  Top 0.4: 38.97,53.2 v39.2,53.2 39.2,53.86 28.46,64.6 23.4,64.6 20.1,67.9 20.1,71.4 30.67,81.97 v30.67,82.63
  Bottom 0.4: v39.2,53.2 39.2,51.27 42.28,48.18 | 42.28,48.18 U$1.37 42.28,48.18 | JP2.1 39.53,82.63 v30.67,82.63 | 42.28,48.18
I/O6  (via drill 1 pad 1.3)
  Top 0.4: v37.2,53.2 37.2,54.87 28.27,63.8 23,63.8 20.1,66.7 17.2,66.7 15.3,68.6 15.3,76.9 17.96,79.56 JP3.1
  Bottom 0.4: 41.82,47.52 U$1.36 41.82,47.52 | 41.82,47.52 37.2,52.14 v37.2,53.2 | 41.82,47.52
I/O7  (via drill 1 pad 1.3)
  Top 0.4: v36.8,17.9 35.8,16.9 21.3,16.9 16.46,12.06 JP4.1
  Bottom 0.4: v36.8,17.9 36.8,30.57 44.97,38.73 | 44.97,38.73 U$1.26 44.97,38.73 | 44.97,38.73
I/O8  (via drill 1 pad 1.3)
  Top 0.4: v46.2,17 46.2,13.3 52.9,6.6 65.56,6.6 JP5.1
  Bottom 0.4: 50.24,36.84 U$1.22 50.24,36.84 | 50.24,36.84 52.9,34.17 v52.9,30.2 46.2,23.5 v46.2,17 | 50.24,36.84
I/O9  (via drill 1 pad 1.3)
  Top 0.4: v38.2,15.8 38.2,9.8 42.3,5.7 JP6.1
  Bottom 0.4: 45.48,38.12 38.2,30.84 v38.2,15.8 | 45.48,38.12 U$1.25 45.48,38.12 | 45.48,38.12
I/O10
  Bottom 0.4: 41.01,42.69 U$1.33 41.01,42.7 41.01,42.69 | 41.01,42.69 40.41,42.09 35.05,36.65 34.3,35.9 31.8,35.9 31.1,36.6 R23.2
I/O11
  Bottom 0.4: 50.16,51.84 U$1.1 50.16,51.84 | 50.16,51.84 51.8,53.49 R24.2 | 50.16,51.84
I/O13  (via drill 1 pad 1.3)
  Bottom 0.4: v62.2,59.8 62.2,55.97 U$1.8
MISO
  Bottom 0.4: ICSP.1 71,70.09 71,66.3 65.2,60.5 65.2,55.57 55.96,46.34 | 55.96,46.34 U$1.11 55.96,46.34 | 55.96,46.34
MOSI
  Bottom 0.4: U$1.10 64.4,55.91 64.4,70.7 66.4,72.7 ICSP.4 | U$1.10
N$1  (via drill 1 pad 1.3, 1 pad 1.4)
  Top 0.4: v40.77,44.47 52.83,44.47 v65.9,31.4 | v17.05,54.9 19,54.9 20.4,53.5 20.4,47.19 v21.75,45.84
  Bottom 0.4: IC2.5 v65.9,31.4 R3.1 | IC2.5 | v40.77,44.47 36.43,44.47 31.85,49.05 24.96,49.05 v21.75,45.84 | CZ3.KOLEKTOR 10.98,83.39 12.38,81.98 12.38,81.2 16.74,76.84 18.66,76.84 20.45,75.05 20.45,69.55 17.05,66.15 17.05,62.6 19.7,59.95 19.7,57.55 v17.05,54.9
N$2  (via drill 1 pad 1.3)
  Top 0.4: K.A 32.5,46.3 v31.1,44.9
  Bottom 0.4: R23.1 v31.1,44.9
N$3
  pour Bottom: 0,88 0,76.7 13.6,76.7 13.6,11.3 0,11.3 0,0 95,0 95,11.3 81.3,11.3 81.3,76.7 94.9,76.7 94.9,88
N$5
  cutout Bottom: 31,45.1 30.8,44.9 29.5,44.9 29.5,42.4 29.6,42.3 31.1,42.3 31,42.4
N$6
  pour Top: 0,88 0,76.7 13.6,76.7 13.6,11.3 0,11.3 0,0 95,0 95,11.3 81.3,11.3 81.3,76.7 94.9,76.7 94.9,88
N$7  (via drill 1 pad 1.3)
  Top 0.4: v23.2,52.1 24.3,51 5V.A
  Bottom 0.4: R12.1 v23.2,52.1
N$8
  cutout Bottom: 23.6,70.8 23.2,70.4 23.2,69.5 23.6,69.1 25.7,69.1 25.9,69.3 25.9,70.8
N$9  (via drill 1 pad 1.3)
  Top 0.4: v27.7,43 ON.A
  Bottom 0.4: R22.1 25.95,44.35 27.3,43 v27.7,43
N$11
  Bottom 0.4: R26.1 54.8,71.8 57.2,74.2 USB.2
N$12
  Bottom 0.4: R25.1 56.5,68 58.15,69.65 USB.3
N$13  (via drill 1 pad 1.4)
  Top 0.4: v71.6,36.1 LED1.A
  Bottom 0.4: R18.1 73.7,34.4 72,36.1 v71.6,36.1
N$14
  Bottom 0.4: R4.1 4.62,81.37 1.63,81.37 1.45,81.55 1.45,84.45 2.2,85.2 CZ3.ANODA
N$15  (via drill 1 pad 1.4)
  Top 0.4: LED2.A v74.2,40.7
  Bottom 0.4: v74.2,40.7 74.2,39.9 74.5,39.6 R19.1
N$16  (via drill 1 pad 1.4)
  Top 0.4: LED3.A v50.7,14.9
  Bottom 0.4: v50.7,14.9 R20.1
N$17  (via drill 1 pad 1.4)
  Top 0.4: LED4.A v54.9,14.9
  Bottom 0.4: v54.9,14.9 R21.1
N$18  (via drill 1 pad 1.3)
  Top 0.4: L7.A 50.8,62.6 v51.1,62.3
  Bottom 0.4: v51.1,62.3 51.1,60.2 51.8,59.5 R24.1
N$19
  Bottom 0.4: R8.1 92.1,81.5 92.6,82 92.6,82.8 92,83.4 CZ2.ANODA
N$20
  cutout Bottom: 63.2,30.4 61.9,29.1 61.9,28.9 61.9,27.9 62.8,27 63.7,27 64.8,28.1 63.2,29.7
N$21
  cutout Bottom: 61.9,27 61.8,26.9 61.8,25.4 62.2,25 62.9,25 63.2,25 63.7,25.5 63.7,26.6 63.5,26.8 63.3,27
N$22
  cutout Bottom: 28.4,10.7 28.4,9.7 28.3,9.6 29.9,9.6 30.1,9.8 29.2,10.7
N$23
  Bottom 0.4: R11.1 91.3,6.5 91.8,6 91.8,3.3 91.3,2.8 CZ1.ANODA
N$27
  Bottom 0.4: CZ4.ANODA 2.4,4.6 1.8,5.2 1.8,5.9 2.4,6.5 R14.1
PIN
  Top 0.4: VCC.2 50.97,73.7 39.99,73.7 38.99,74.7 DRIVE.8
POT
  Bottom 0.4: IC2.4 62.6,29.9 | 62.6,29.9 61.85,29.15 61.85,27.85 62.85,26.85 | 62.85,26.85 63.6,26.1 | 63.6,26.1 64.5,25.2 | 61.35,26.85 62.85,26.85 | IC2.8 62.34,24.26 | 62.74,24.66 62.99,24.91 | 62.99,24.91 63.29,25.2 64.5,25.2 | 64.4,28.1 IC2.6 64.4,28.1 | 64.4,28.1 63.6,27.31 63.6,26.1 | IC2.8 62.34,24.26 | 62.34,24.26 62.74,24.66 | 62.74,24.66 | 64.4,28.1 | 62.6,29.9 | 64.5,25.2 65.5,24.2 POT.S | IC2.4 62.6,29.9 | IC2.4 | 61.35,26.85 IC2.10 61.35,26.85 | 61.35,26.85 | 62.74,24.66 62.34,24.26 | 62.34,24.26 | IC2.8 62.99,24.91 | 62.99,24.91
PWMA
  Bottom 0.4: 44.3,39.2 U$1.27 44.3,39.2 | 44.3,39.2 28.13,23.02 IC1.23 | 44.3,39.2
PWMB
  Bottom 0.4: 41.67,42.23 U$1.32 41.67,42.23 | 41.67,42.23 27.67,28.22 IC1.15 | 41.67,42.23
RST  (via drill 1 pad 1.3)
  Top 0.4: ICSP.5 71.2,75.24 71.2,81.6 | RESET.1 31.99,78.69 37.6,84.3 68.5,84.3 71.2,81.6 | 71.2,81.6 73.1,79.7 73.1,54.1 v63.9,44.9
  Bottom 0.4: U$1.13 58.05,39.2 61.53,39.2 63.9,41.57 v63.9,44.9 63.9,48.19 R1.2 | U$1.13 | C3.2 33.8,73.8 31.99,75.61 RESET.1
S2  (via drill 1 pad 1.3)
  Top 0.4: v76.7,84.8 74.5,82.6 74.5,51.6 63.6,40.7 63.6,35.9 67.4,32.1 v67.4,29.3
  Bottom 0.4: IC2.7 67.39,29.3 v67.4,29.3 R7.1 | CZ2.KOLEKTOR 77.11,85.21 v76.7,84.8 | IC2.7
S3  (via drill 1 pad 1.3, 1 pad 1.4)
  Top 0.4: v59.7,23.4 59.7,12.8 61.4,11.1 75.5,11.1 82,4.6 v83.9,4.6
  Bottom 0.4: v59.7,23.41 v59.7,23.4 | R10.1 v59.7,23.4 | CZ1.KOLEKTOR 86.1,4.6 v83.9,4.6 | IC2.9 61.1,24.8 | IC2.9 61.1,24.8 | 61.1,24.8 | v59.7,23.4 61.1,24.8 61.1,24.81 IC2.9 | IC2.9 60.75,24.46
S4  (via drill 1 pad 1.3, 1 pad 1.4)
  Top 0.4: v57.6,8.6 v57.6,24.9
  Bottom 0.4: IC2.11 v57.6,24.9 R13.1 | CZ4.KOLEKTOR 25.39,2.79 30.9,8.3 57.3,8.3 v57.6,8.6 | IC2.11
SCK
  Bottom 0.4: U$1.9 63.6,56.24 63.6,72.9 68.4,77.7 72.1,77.7 73.2,76.6 73.2,73.6 72.3,72.7 ICSP.3 | U$1.9
UCAP
  Bottom 0.4: 53.04,49.07 59.6,55.63 C10.+ | 53.04,49.07 U$1.6 53.04,49.07 | 53.04,49.07
VBUS
  Bottom 0.4: USB.1 60.65,73.35 62.6,71.4 62.6,67.7 60.6,65.7 60.6,55.5 53.6,48.5 U$1.7 | U$1.7
VCC  (via drill 1 pad 1.3)
  Top 0.4: v28.05,14.8 28.05,10.38 v28.07,10.37 35.63,2.8 46.2,2.8 | v18.3,74.3 20.4,74.3 23.1,77 v23.5,77 | 47.7,53.19 v47.7,54.2 47.7,52.5 43,47.8 v35.7,47.8 | v52.3,27 65.7,27 69.8,22.9 69.8,19.46 68.04,17.7 POT.E | ICSP.2 68.53,60.33 v68.4,60.2 | 46.2,2.8 47.5,4.1 JP6.2 | 46.2,2.8 68.2,2.8 69.1,3.7 JP5.2
  Bottom 0.4: R21.2 R17.2 R20.2 R16.2 47,10.85 46.2,11.65 44.8,11.65 | 63.3,32.4 64.4,33.5 70.65,33.5 71.55,32.6 R3.2 | 63.3,32.4 IC2.3 63.3,32.4 | IC1.20 23.38,24.97 22.9,24.5 22.9,21.4 23.75,20.55 C9.2 26.25,20.55 28.05,18.75 v28.05,14.8 28.05,13.75 30.15,11.65 40.1,11.65 | 75.2,61.7 72.7,64.2 70.2,64.2 66,60 66,57.8 | 34.24,52.84 24.82,62.25 | R13.2 R10.2 66.85,17.25 68.04,16.06 POT.E 70.76,14.26 71.55,15.05 | C8.+ 26.99,55.44 C4.2 | C8.+ 24.82,58.38 24.82,62.25 | U$1.2 | R3.2 R7.2 71.55,15.05 | R12.2 23.2,60.63 24.73,62.17 | 40.1,11.65 44.8,11.65 | 66,53.6 66,42.68 61.72,38.4 57.72,38.4 55.11,41.01 | 66,53.6 66,57.8 | 66,53.6 63.88,51.48 R1.1 62.72,50.12 v61.1,48.5 | R9.1 R6.1 R2.1 47.95,73.35 49.7,71.6 49.7,56.19 v47.7,54.19 | U$1.24 42.9,34.41 42.9,14.45 40.1,11.65 | 43.1,79.3 25.8,79.3 v23.5,77 20.5,80 JP3.2 | 43.1,79.3 55.4,79.3 57.5,77.2 61.1,77.2 | 46.59,51.79 48.49,49.9 49.34,49.9 U$1.2 | 46.59,51.79 46.4,51.98 46.4,52.9 | v68.4,60.2 66,57.8 | 46.4,52.9 45.3,51.8 45.3,50.82 U$1.42 | v47.7,54.2 v47.7,54.19 | v47.7,54.19 46.4,52.9 | R4.2 9.5,81.5 16.7,74.3 v18.3,74.3 | R11.2 77.4,6.5 71.55,12.35 71.55,15.05 | R14.2 20.7,6.5 | 20.7,6.5 24.2,6.5 v28.07,10.37 | 75.2,61.7 75.2,77.5 75.05,77.65 | 55.11,41.01 U$1.14 55.11,41.01 | 55.11,41.01 | U$1.44 46.59,51.79 | 46.59,51.79 | v35.7,47.8 34.24,49.26 34.24,52.84 | R3.2 71.6,31.35 R18.2 R5.2 78.75,31.35 79.3,31.9 79.3,39.2 78.9,39.6 R19.2 R15.2 78.05,43.95 76.6,45.4 76.6,48.38 75.2,49.78 75.2,61.7 | 34.24,52.84 34.44,52.64 | 34.44,52.64 47.34,39.74 47.34,38.84 U$1.24 | U$1.34 34.44,52.64 | 34.44,52.64 | 63.3,32.4 | U$1.2 | U$1.2 50.14,50.74 | C8.+ | U$1.24 | C4.2 | 24.73,62.17 24.82,62.25
  Bottom 0.4: 75.05,77.65 72.9,79.8 69.4,79.8 66.8,77.2 61.1,77.2 | 62.2,79.3 JP1.2 62.2,78.3 61.1,77.2 | JP2.2 43.1,81.4 43.1,79.3 | 20.7,6.5 19,8.2 JP4.2 | 44.8,11.65 44.8,12.6 47.86,15.66 47.86,22.56 v52.3,27 | 24.73,62.17 24.73,63.11 IC3.2 | R8.2 78.9,81.5 75.05,77.65
VM  (via drill 1 pad 1.3)
  Top 0.4: v29.49,31.81 29.49,29.71 v33.1,26.1 | 29.49,60.81 v29.1,61.2 29.5,60.8 v29.5,47.8
  Bottom 0.4: IC3.1 29.78,61.88 v29.1,61.2 30.9,61.2 31.18,60.92 | IC1.24 29.38,22.38 v33.1,26.1 | v29.49,31.81 29.49,31.09 27.93,29.52 26.4,29.52 | C7.2 27.86,31.81 v29.49,31.81 | IC1.13 26.4,29.52 | IC1.14 25.75,28.88 26.4,29.52 | v29.49,31.81 29.49,45.9 | 29.49,45.9 29.49,47.8 v29.5,47.8 | DRIVE.1 38.99,67.93 C5.2 31.96,60.91 C6.+ 31.18,60.92 | 31.18,60.92 | R22.2 28.69,46.7 29.49,45.9
XTAL1
  Bottom 0.4: U$1.17 56.73,36 62.3,36 68.7,42.4 73,42.4 75.9,45.3 75.9,48.09 73.62,50.37 73.62,58.32 Q1.2 68.32,57.78 68.32,51.7 67.33,50.71 67.33,47.9 C1.2 | U$1.17
XTAL2
  Bottom 0.4: 53.63,40.23 U$1.16 53.63,40.23 | 53.63,40.23 57.06,36.8 62.1,36.8 68.5,43.2 72.7,43.2 75.1,45.6 75.1,47.9 71.8,51.2 Q1.1 69.38,49.34 C2.2 | 53.63,40.23

### Text on the board
Top: CalkaBot 2.0 | developed by Deli